# EAGLE schematic eib-128 (EAGLE 6.5.0)
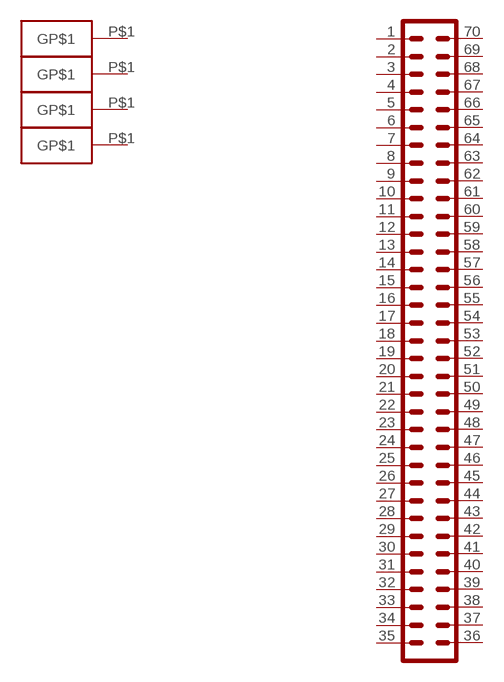
[diagram p0: schematic, sheet 1]

## Parts
U$1  PINHD-2X35_DF40HEAD  [DF40-70HEAD]
U$2  GOLDPIN_0.5MM  [GOLDPIN-0.5MM]
U$3  GOLDPIN_0.5MM  [GOLDPIN-0.5MM]
U$4  GOLDPIN_0.5MM  [GOLDPIN-0.5MM]
U$5  GOLDPIN_0.5MM  [GOLDPIN-0.5MM]
Unconnected: U$1.1 U$1.2 U$1.3 U$1.4 U$1.5 U$1.6 U$1.7 U$1.8 U$1.9 U$1.10 U$1.11 U$1.12 U$1.13 U$1.14 U$1.15 U$1.16 U$1.17 U$1.18 U$1.19 U$1.20 U$1.21 U$1.22 U$1.23 U$1.24 U$1.25 U$1.26 U$1.27 U$1.28 U$1.29 U$1.30 U$1.31 U$1.32 U$1.33 U$1.34 U$1.35 U$1.36 U$1.37 U$1.38 U$1.39 U$1.40 U$1.41 U$1.42 U$1.43 U$1.44 U$1.45 U$1.46 U$1.47 U$1.48 U$1.49 U$1.50 U$1.51 U$1.52 U$1.53 U$1.54 U$1.55 U$1.56 U$1.57 U$1.58 U$1.59 U$1.60 U$1.61 U$1.62 U$1.63 U$1.64 U$1.65 U$1.66 U$1.67 U$1.68 U$1.69 U$1.70 U$2.P$1(GP$1) U$3.P$1(GP$1) U$4.P$1(GP$1) U$5.P$1(GP$1)

## Library data of the parts
U$1 = jonnew:PINHD-2X35
U$2-U$5 = jonnew:GOLDPIN